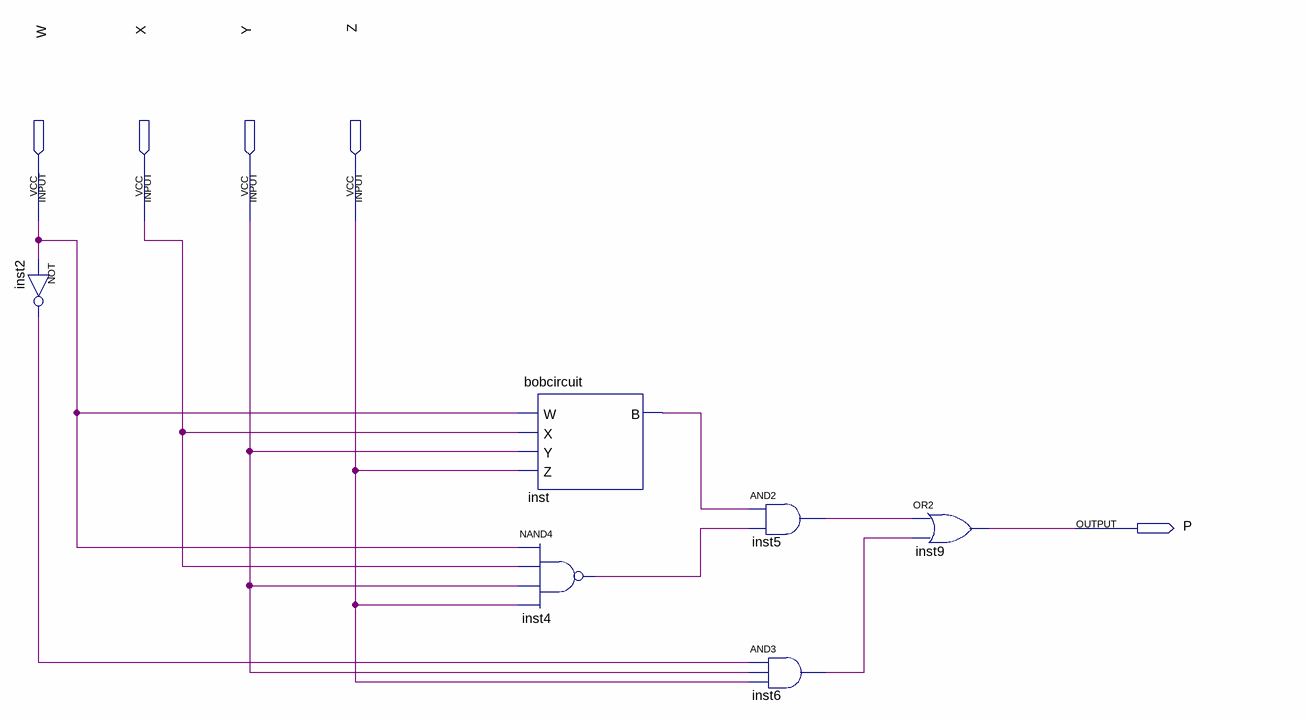
[diagram p0: schematic sheet]
// Quartus schematic correctedbobcircuit.bdf as structural Verilog: 6 symbols, 5 pins
module correctedbobcircuit (
  input  W,
  input  X,
  input  Y,
  input  Z,
  output P
);

  wire inst2_out, inst4_out, inst5_out, inst6_out, inst_b;

  not inst2 (inst2_out, W);
  bobcircuit inst (.W(W), .X(X), .Y(Y), .Z(Z), .B(inst_b));
  nand inst4 (inst4_out, W, X, Y, Z);
  and inst5 (inst5_out, inst_b, inst4_out);
  and inst6 (inst6_out, inst2_out, Y, Z);
  or inst9 (P, inst5_out, inst6_out);
endmodule
